# Altium schematic sheet GLOBAL.SchDoc
size A
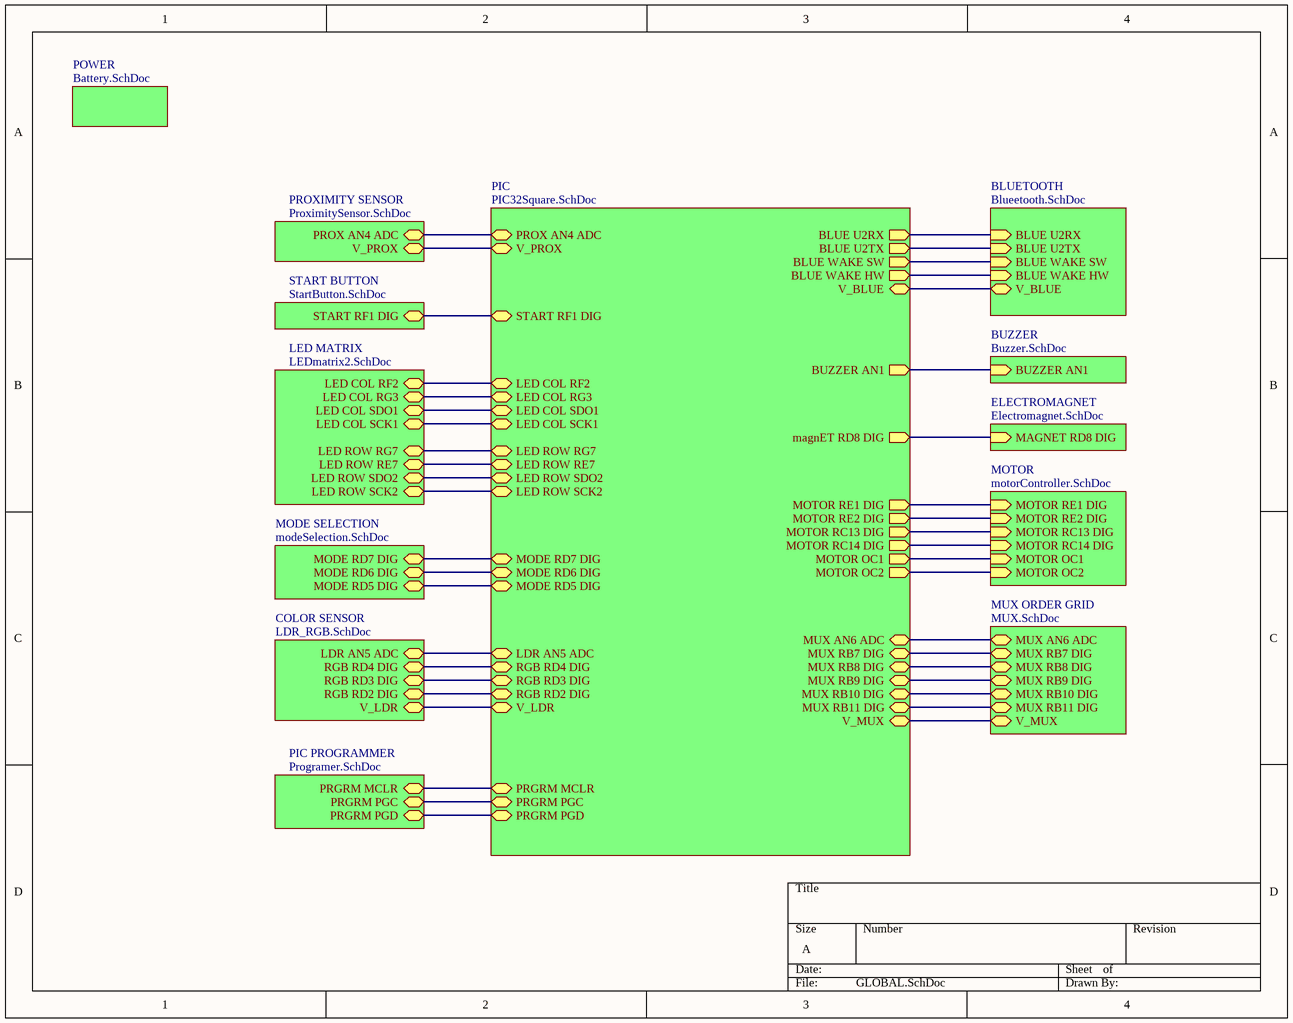
[diagram p0: GLOBAL.SchDoc]

## Sub-sheets
BLUETOOTH = Blueetooth.SchDoc: BLUE U2RX (in), BLUE U2TX (in), BLUE WAKE SW (in), BLUE WAKE HW (in), V_BLUE
BUZZER = Buzzer.SchDoc: BUZZER AN1 (in)
COLOR SENSOR = LDR_RGB.SchDoc: LDR AN5 ADC, RGB RD4 DIG, RGB RD3 DIG, RGB RD2 DIG, V_LDR
ELECTROMAGNET = Electromagnet.SchDoc: MAGNET RD8 DIG (in)
LED MATRIX = LEDmatrix2.SchDoc: LED COL RF2, LED COL RG3, LED COL SDO1, LED COL SCK1, LED ROW RG7, LED ROW RE7, LED ROW SDO2, LED ROW SCK2
MODE SELECTION = modeSelection.SchDoc: MODE RD7 DIG, MODE RD6 DIG, MODE RD5 DIG
MOTOR = motorController.SchDoc: MOTOR RE1 DIG (in), MOTOR RE2 DIG (in), MOTOR RC13 DIG (in), MOTOR RC14 DIG (in), MOTOR OC1 (in), MOTOR OC2 (in)
MUX ORDER GRID = MUX.SchDoc: MUX AN6 ADC, MUX RB7 DIG, MUX RB8 DIG, MUX RB9 DIG, MUX RB10 DIG, MUX RB11 DIG, V_MUX
PIC = PIC32Square.SchDoc: BLUE U2RX (out), BLUE U2TX (out), BLUE WAKE SW (out), BLUE WAKE HW (out), BUZZER AN1 (out), magnET RD8 DIG (out), MOTOR RE1 DIG (out), MOTOR RE2 DIG (out), MOTOR RC13 DIG (out), MOTOR RC14 DIG (out), MOTOR OC1 (out), MOTOR OC2 (out), PROX AN4 ADC, START RF1 DIG, LED COL RF2, LED COL RG3, LED COL SDO1, LED COL SCK1, LED ROW RG7, LED ROW RE7, LED ROW SDO2, LED ROW SCK2, MODE RD7 DIG, MODE RD6 DIG, MODE RD5 DIG, LDR AN5 ADC, RGB RD4 DIG, RGB RD3 DIG, RGB RD2 DIG, MUX AN6 ADC, MUX RB7 DIG, MUX RB8 DIG, MUX RB9 DIG, MUX RB10 DIG, MUX RB11 DIG, V_BLUE, V_MUX, V_PROX, V_LDR, PRGRM MCLR, PRGRM PGD, PRGRM PGC
PIC PROGRAMMER = Programer.SchDoc: PRGRM MCLR, PRGRM PGC, PRGRM PGD
POWER = Battery.SchDoc: no entries
PROXIMITY SENSOR = ProximitySensor.SchDoc: PROX AN4 ADC, V_PROX
START BUTTON = StartButton.SchDoc: START RF1 DIG

## Nets
(unnamed): sheet PIC/BLUE U2RX, sheet BLUETOOTH/BLUE U2RX
(unnamed): sheet PIC/BLUE U2TX, sheet BLUETOOTH/BLUE U2TX
(unnamed): sheet PIC/BLUE WAKE SW, sheet BLUETOOTH/BLUE WAKE SW
(unnamed): sheet PIC/BLUE WAKE HW, sheet BLUETOOTH/BLUE WAKE HW
(unnamed): sheet PIC/BUZZER AN1, sheet BUZZER/BUZZER AN1
(unnamed): sheet PIC/magnET RD8 DIG, sheet ELECTROMAGNET/MAGNET RD8 DIG
(unnamed): sheet PIC/MOTOR RE1 DIG, sheet MOTOR/MOTOR RE1 DIG
(unnamed): sheet PIC/MOTOR RE2 DIG, sheet MOTOR/MOTOR RE2 DIG
(unnamed): sheet PIC/MOTOR RC13 DIG, sheet MOTOR/MOTOR RC13 DIG
(unnamed): sheet PIC/MOTOR RC14 DIG, sheet MOTOR/MOTOR RC14 DIG
(unnamed): sheet PIC/MOTOR OC1, sheet MOTOR/MOTOR OC1
(unnamed): sheet PIC/MOTOR OC2, sheet MOTOR/MOTOR OC2
(unnamed): sheet PIC/PROX AN4 ADC, sheet PROXIMITY SENSOR/PROX AN4 ADC
(unnamed): sheet PIC/START RF1 DIG, sheet START BUTTON/START RF1 DIG
(unnamed): sheet PIC/LED COL RF2, sheet LED MATRIX/LED COL RF2
(unnamed): sheet PIC/LED COL RG3, sheet LED MATRIX/LED COL RG3
(unnamed): sheet PIC/LED COL SDO1, sheet LED MATRIX/LED COL SDO1
(unnamed): sheet PIC/LED COL SCK1, sheet LED MATRIX/LED COL SCK1
(unnamed): sheet PIC/LED ROW RG7, sheet LED MATRIX/LED ROW RG7
(unnamed): sheet PIC/LED ROW RE7, sheet LED MATRIX/LED ROW RE7
(unnamed): sheet PIC/LED ROW SDO2, sheet LED MATRIX/LED ROW SDO2
(unnamed): sheet PIC/LED ROW SCK2, sheet LED MATRIX/LED ROW SCK2
(unnamed): sheet PIC/MODE RD7 DIG, sheet MODE SELECTION/MODE RD7 DIG
(unnamed): sheet PIC/MODE RD6 DIG, sheet MODE SELECTION/MODE RD6 DIG
(unnamed): sheet PIC/MODE RD5 DIG, sheet MODE SELECTION/MODE RD5 DIG
(unnamed): sheet PIC/LDR AN5 ADC, sheet COLOR SENSOR/LDR AN5 ADC
(unnamed): sheet PIC/RGB RD4 DIG, sheet COLOR SENSOR/RGB RD4 DIG
(unnamed): sheet PIC/RGB RD3 DIG, sheet COLOR SENSOR/RGB RD3 DIG
(unnamed): sheet PIC/RGB RD2 DIG, sheet COLOR SENSOR/RGB RD2 DIG
(unnamed): sheet PIC/MUX AN6 ADC, sheet MUX ORDER GRID/MUX AN6 ADC
(unnamed): sheet PIC/MUX RB7 DIG, sheet MUX ORDER GRID/MUX RB7 DIG
(unnamed): sheet PIC/MUX RB8 DIG, sheet MUX ORDER GRID/MUX RB8 DIG
(unnamed): sheet PIC/MUX RB9 DIG, sheet MUX ORDER GRID/MUX RB9 DIG
(unnamed): sheet PIC/MUX RB10 DIG, sheet MUX ORDER GRID/MUX RB10 DIG
(unnamed): sheet PIC/MUX RB11 DIG, sheet MUX ORDER GRID/MUX RB11 DIG
(unnamed): sheet PIC/V_BLUE, sheet BLUETOOTH/V_BLUE
(unnamed): sheet PIC/V_MUX, sheet MUX ORDER GRID/V_MUX
(unnamed): sheet PIC/V_PROX, sheet PROXIMITY SENSOR/V_PROX
(unnamed): sheet PIC/V_LDR, sheet COLOR SENSOR/V_LDR
(unnamed): sheet PIC/PRGRM MCLR, sheet PIC PROGRAMMER/PRGRM MCLR
(unnamed): sheet PIC/PRGRM PGD, sheet PIC PROGRAMMER/PRGRM PGD
(unnamed): sheet PIC/PRGRM PGC, sheet PIC PROGRAMMER/PRGRM PGC